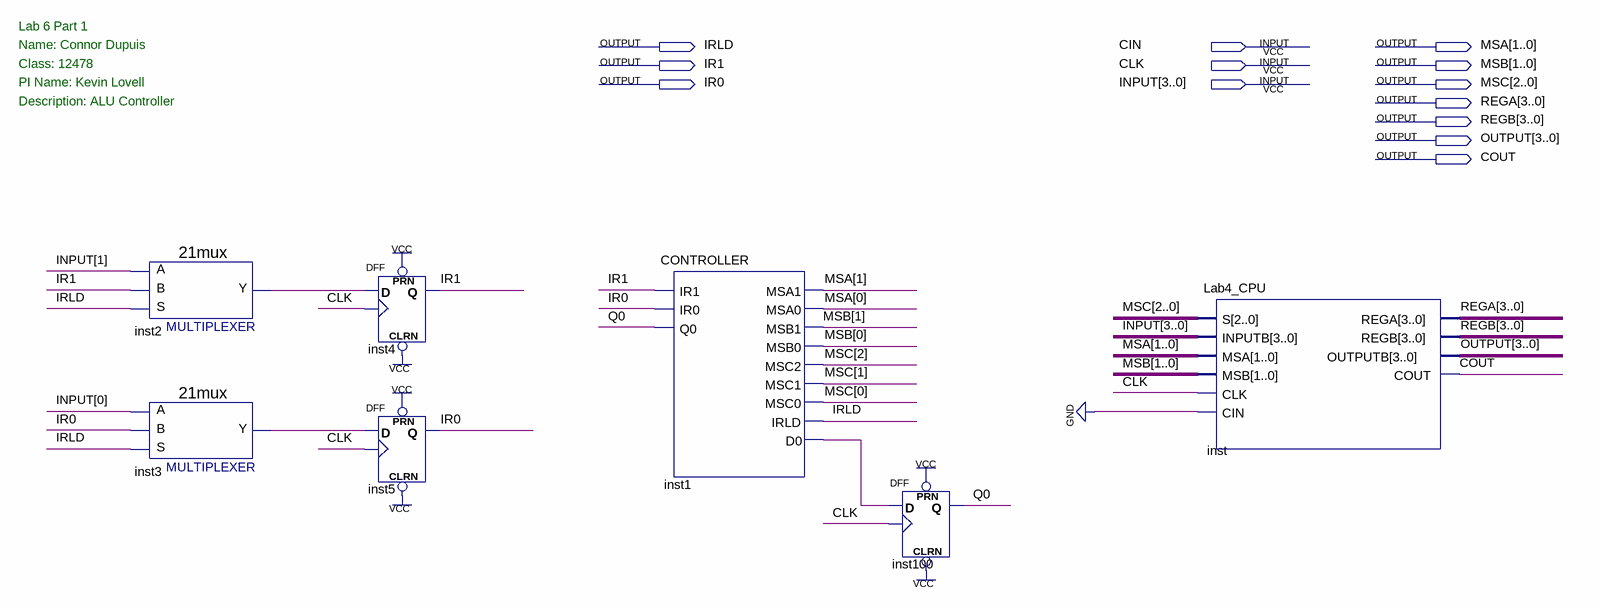
[diagram p0: schematic sheet]
// Quartus schematic Lab6_Part1.bdf as structural Verilog: 7 symbols, 13 pins
module Lab6_Part1 (
  input  CIN,
  input  CLK,
  input  [3:0] INPUT,
  output IRLD,
  output [1:0] MSA,
  output IR1,
  output [1:0] MSB,
  output IR0,
  output [2:0] MSC,
  output [3:0] REGA,
  output [3:0] REGB,
  output [3:0] OUTPUT,
  output COUT
);

  wire inst1_d0, inst2_y, inst3_y, Q0;

  \21mux  inst2 (.S(IRLD), .B(IR1), .A(INPUT[1]), .Y(inst2_y));
  \21mux  inst3 (.S(IRLD), .B(IR0), .A(INPUT[0]), .Y(inst3_y));
  DFF inst4 (.CLRN(1'b1), .CLK(CLK), .D(inst2_y), .PRN(1'b1), .Q(IR1));
  DFF inst5 (.CLRN(1'b1), .CLK(CLK), .D(inst3_y), .PRN(1'b1), .Q(IR0));
  CONTROLLER inst1 (
    .IR1(IR1), .IR0(IR0), .Q0(Q0), .MSA1(MSA[1]), .MSA0(MSA[0]), .MSB1(MSB[1]), .MSB0(MSB[0]), .MSC2(MSC[2]),
    .MSC1(MSC[1]), .MSC0(MSC[0]), .IRLD(IRLD), .D0(inst1_d0));
  DFF inst100 (.CLRN(1'b1), .CLK(CLK), .D(inst1_d0), .PRN(1'b1), .Q(Q0));
  Lab4_CPU inst (
    .S(MSC), .INPUTB(INPUT), .MSA(MSA), .MSB(MSB), .CLK(CLK), .CIN(1'b0), .REGA(REGA), .REGB(REGB),
    .OUTPUTB(OUTPUT), .COUT(COUT));

  // Notes on the sheet:
  //   Lab 6 Part 1
  //   Name: Connor Dupuis
  //   Class: 12478
  //   PI Name: Kevin Lovell
  //   Description: ALU Controller
endmodule
